# EAGLE design adapter28 (EAGLE 9.4.2)
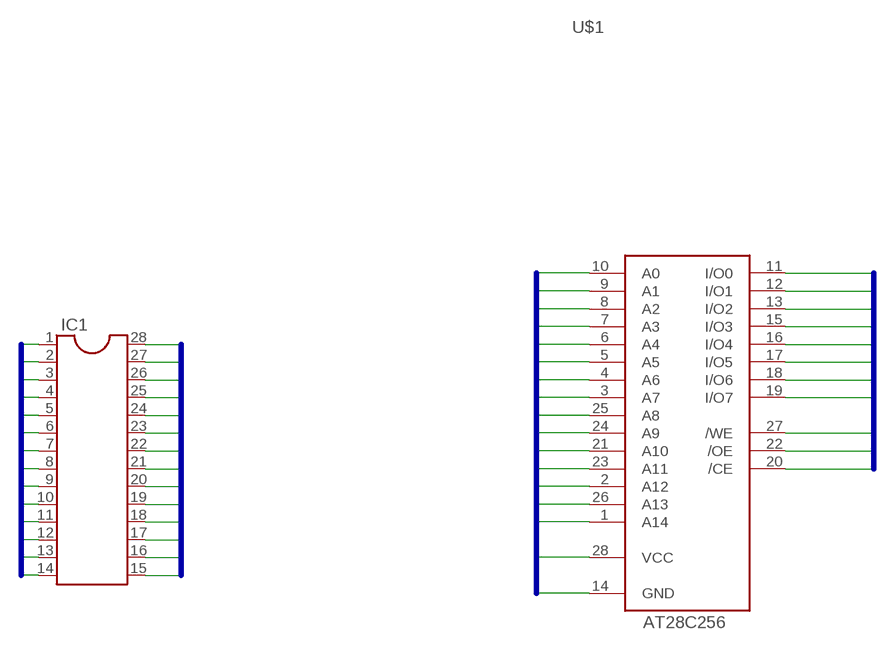
[diagram p0: schematic, sheet 1]

## Parts
IC1  DIL28  [DIL28-6]
U$1  AT28C256  [DIL28-3-ZIF_SOCKET]

## Nets
P1: IC1.1 U$1.1(A14)
P2: IC1.2 U$1.2(A12)
P3: IC1.3 U$1.3(A7)
P4: IC1.4 U$1.4(A6)
P5: IC1.5 U$1.5(A5)
P6: IC1.6 U$1.6(A4)
P7: IC1.7 U$1.7(A3)
P8: IC1.8 U$1.8(A2)
P9: IC1.9 U$1.9(A1)
P10: IC1.10 U$1.10(A0)
P11: IC1.11 U$1.11(I/O0)
P12: IC1.12 U$1.12(I/O1)
P13: IC1.13 U$1.13(I/O2)
P14: IC1.14 U$1.14(GND)
P15: IC1.15 U$1.15(I/O3)
P16: IC1.16 U$1.16(I/O4)
P17: IC1.17 U$1.17(I/O5)
P18: IC1.18 U$1.18(I/O6)
P19: IC1.19 U$1.19(I/O7)
P20: IC1.20 U$1.20(/CE)
P21: IC1.21 U$1.21(A10)
P22: IC1.22 U$1.22(/OE)
P23: IC1.23 U$1.23(A11)
P24: IC1.24 U$1.24(A9)
P25: IC1.25 U$1.25(A8)
P26: IC1.26 U$1.26(A13)
P27: IC1.27 U$1.27(/WE)
P28: IC1.28 U$1.28(VCC)

## Buses
DIL28:P1,P2,P3,P4,P5,P6,P7,P8,P9,P10,P11,P12,P13,P14,P15,P16,P17,P18,P19,P20,P21,P22,P23,P24,P25,P26,P27,P28

## Library data of the parts
IC1 = ic-package:DIL28: Dual In Line
U$1 = wntrmute:AT28C256

## Net classes
0 default: width 0.152 mm, drill 0.254 mm, clearance 0.152 mm

## Board
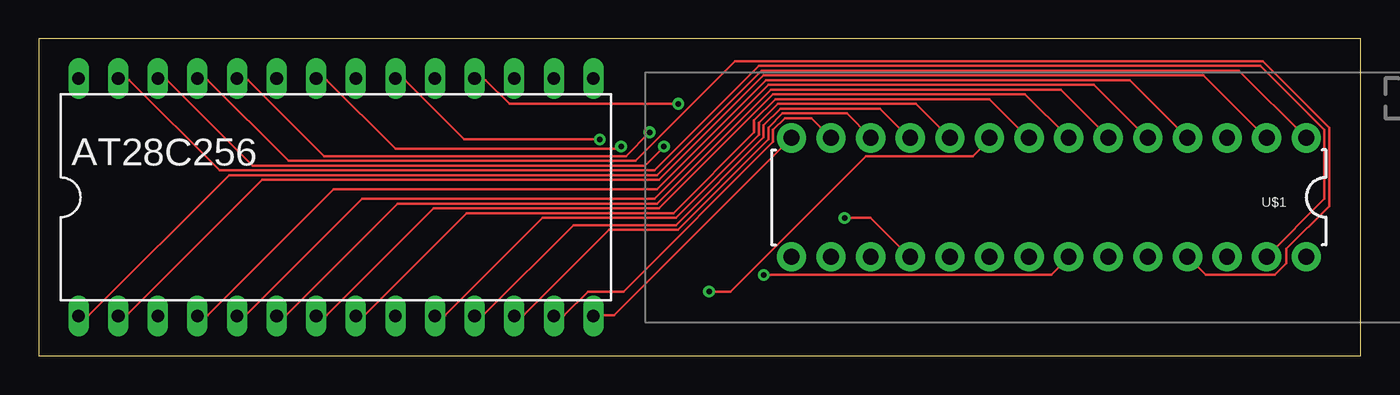
[diagram p1: board, top side]
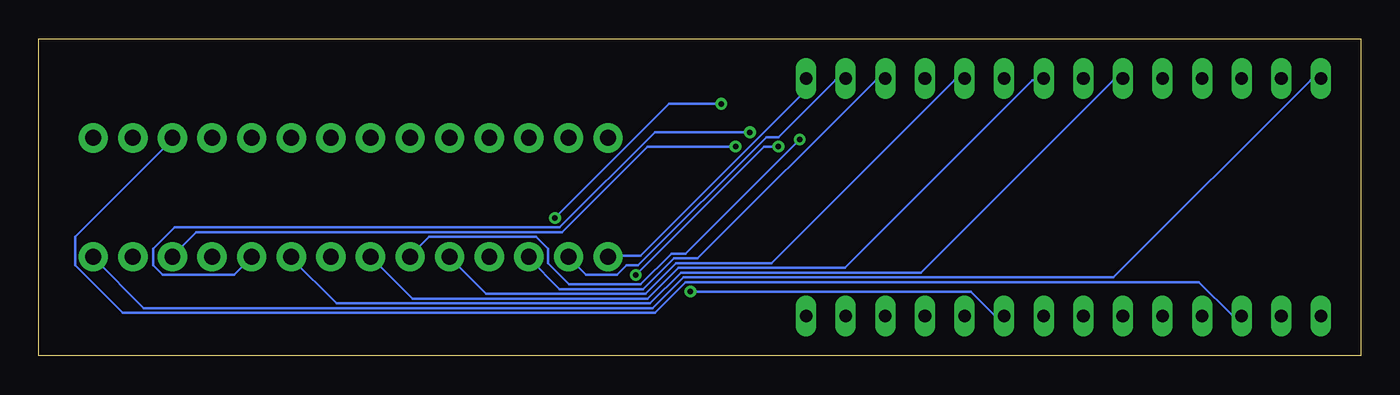
[diagram p2: board, bottom side, seen from below]

Size 84.76 x 20.31 mm. Coordinates in mm from the lower left corner, seen from the top.
Outline: 0,0 84.76,0 84.76,20.31 0,20.31 0,0
Copper layers (1*16): Top 0.035mm / dielectric 1.5mm / Bottom 0.035mm
Design rules "default": minimum track width 6mil, minimum drill 0.35mm, track to track 6mil, track to pad 6mil, pad to pad 6mil, via to via 6mil, smd to smd 6mil, copper to edge 40mil, drill to drill 6mil, minimum pad ring 10mil, minimum via ring 8mil, stop-mask expansion 4mil, vias tented up to drill 0mil, thermal gap 10mil

### Footprints (pad centres in the part's own frame; a part is rotated, then mirrored left to right if it is on the bottom)
DIL28-6 = drill 0.813 long: 1 -16.51,-7.62; 2 -13.97,-7.62; 3 -11.43,-7.62; 4 -8.89,-7.62; 5 -6.35,-7.62; 6 -3.81,-7.62; 7 -1.27,-7.62; 8 1.27,-7.62; 9 3.81,-7.62; 10 6.35,-7.62; 11 8.89,-7.62; 12 11.43,-7.62; 13 13.97,-7.62; 14 16.51,-7.62; 15 16.51,7.62; 16 13.97,7.62; 17 11.43,7.62; 18 8.89,7.62; 19 6.35,7.62; 20 3.81,7.62; 21 1.27,7.62; 22 -1.27,7.62; 23 -3.81,7.62; 24 -6.35,7.62; 25 -8.89,7.62; 26 -11.43,7.62; 27 -13.97,7.62; 28 -16.51,7.62
DIL28-3-ZIF_SOCKET = drill 1.016 pad 1.88: 1 -16.51,-3.81; 2 -13.97,-3.81; 3 -11.43,-3.81; 4 -8.89,-3.81; 5 -6.35,-3.81; 6 -3.81,-3.81; 7 -1.27,-3.81; 8 1.27,-3.81; 9 3.81,-3.81; 10 6.35,-3.81; 11 8.89,-3.81; 12 11.43,-3.81; 13 13.97,-3.81; 14 16.51,-3.81; 15 16.51,3.81; 16 13.97,3.81; 17 11.43,3.81; 18 8.89,3.81; 19 6.35,3.81; 20 3.81,3.81; 21 1.27,3.81; 22 -1.27,3.81; 23 -3.81,3.81; 24 -6.35,3.81; 25 -8.89,3.81; 26 -11.43,3.81; 27 -13.97,3.81; 28 -16.51,3.81

### Placement (x,y rotation side)
IC1  19.05,10.16 0 top
U$1  64.77,10.16 180 top

### Tracks (layer width: path | path; a pad name or v marks a point on that pad's centre or on a via)
P1
  Top 0.152: U$1.1 76.96,18.29 46.33,18.29 39.62,11.58 12.19,11.58 3.2,2.59 2.59,2.59 IC1.1
P2
  Top 0.152: IC1.2 5.18,2.59 5.64,2.59 14.33,11.28 39.78,11.28 46.48,17.98 74.68,17.98 78.64,14.02 U$1.2
P3
  Bottom 0.152: IC1.3 7.62,2.59 8.23,2.59 10.36,4.72 43.28,4.72 45.26,2.74 79.4,2.74 82.45,5.79 82.45,7.62 76.2,13.87 U$1.3
P4
  Top 0.152: U$1.4 69.95,17.68 46.63,17.68 39.62,10.67 18.9,10.67 10.82,2.59 10.21,2.59 IC1.4
P5
  Top 0.152: IC1.5 12.8,2.59 13.26,2.59 20.73,10.06 39.47,10.06 46.79,17.37 67.67,17.37 71.02,14.02 U$1.5
P6
  Top 0.152: IC1.6 15.24,2.59 15.85,2.59 23.01,9.75 39.62,9.75 46.94,17.07 65.53,17.07 68.58,14.02 U$1.6
P7
  Top 0.152: U$1.7 63.25,16.76 47.09,16.76 39.78,9.45 25.3,9.45 18.44,2.59 17.83,2.59 IC1.7
P8
  Top 0.152: IC1.8 20.42,2.59 20.88,2.59 27.43,9.14 40.69,9.14 45.87,14.33 45.87,15.09 47.24,16.46 60.96,16.46 63.4,14.02 U$1.8
P9  (via drill 0.35)
  Top 0.152: v42.98,4.12 44.35,4.12 53.03,12.8 59.89,12.8 60.96,13.87 U$1.9
  Bottom 0.152: v42.98,4.12 24.99,4.12 23.47,2.59 22.86,2.59 IC1.9
P10
  Top 0.152: U$1.10 56.24,16.15 47.4,16.15 46.18,14.94 46.18,14.17 40.84,8.84 32.31,8.84 26.06,2.59 25.45,2.59 IC1.10
P11
  Top 0.152: IC1.11 28.04,2.59 28.5,2.59 34.29,8.38 40.84,8.38 46.48,14.02 46.48,14.78 47.55,15.85 53.95,15.85 55.78,14.02 U$1.11
P12
  Top 0.152: IC1.12 30.48,2.59 31.09,2.59 36.58,8.08 41,8.08 46.79,13.87 46.79,14.63 47.7,15.54 51.82,15.54 53.34,14.02 U$1.12
P13
  Top 0.152: U$1.13 49.53,15.24 47.85,15.24 47.09,14.48 47.09,13.72 37.49,4.12 35.2,4.12 33.68,2.59 33.07,2.59 IC1.13
P14
  Top 0.152: U$1.14 36.88,2.59 35.66,2.59 IC1.14
P15
  Bottom 0.152: IC1.15 35.66,17.68 35.66,16.92 46.18,6.4 48.16,6.4 U$1.15
P16
  Bottom 0.152: IC1.16 33.07,17.68 33.68,17.68 37.34,14.02 38.1,14.02 46.33,5.79 47.09,5.79 47.7,5.18 49.68,5.18 50.75,6.25 U$1.16
P17
  Bottom 0.152: IC1.17 30.48,17.68 31.09,17.68 42.52,6.25 44.04,6.25 46.02,4.27 51.36,4.27 53.34,6.25 U$1.17
P18  (via drill 0.35)
  Top 0.152: v41,16.15 30.18,16.15 28.65,17.68 28.04,17.68 IC1.18 | v51.66,8.84 53.34,8.84 55.78,6.4 U$1.18
  Bottom 0.152: v41,16.15 44.35,16.15 v51.66,8.84
P19
  Bottom 0.152: IC1.19 25.45,17.68 26.06,17.68 37.8,5.94 43.89,5.94 45.87,3.96 56.08,3.96 58.37,6.25 U$1.19
P20  (via drill 0.35)
  Top 0.152: v35.97,13.87 27.28,13.87 23.47,17.68 22.86,17.68 IC1.20
  Bottom 0.152: v35.97,13.87 43.28,6.55 44.2,6.55 46.18,4.57 50.75,4.57 52.12,5.94 52.12,6.86 52.88,7.62 59.74,7.62 60.96,6.4 U$1.20
P21
  Bottom 0.152: U$1.21 60.81,3.66 45.72,3.66 43.74,5.64 33.07,5.64 21.03,17.68 20.42,17.68 IC1.21
P22  (via drill 0.35)
  Top 0.152: v37.34,13.41 37.19,13.26 22.86,13.26 18.44,17.68 17.83,17.68 IC1.22 | v46.48,5.18 64.92,5.18 65.99,6.25 U$1.22
  Bottom 0.152: v37.34,13.41 38.25,13.41 v46.48,5.18
P23
  Bottom 0.152: IC1.23 15.24,17.68 15.85,17.68 28.19,5.33 43.59,5.33 45.57,3.35 65.68,3.35 68.58,6.25 U$1.23
P24  (via drill 0.35)
  Top 0.152: v39.17,14.33 37.64,12.8 18.29,12.8 13.41,17.68 12.8,17.68 IC1.24
  Bottom 0.152: v39.17,14.33 45.26,14.33 51.36,8.23 76.05,8.23 77.42,6.86 77.42,5.79 76.81,5.18 72.24,5.18 71.17,6.25 U$1.24
P25
  Top 0.152: U$1.25 74.83,5.18 79.25,5.18 80.01,5.94 80.01,6.86 82.75,9.6 82.75,14.63 78.49,18.9 44.65,18.9 38.25,12.5 16,12.5 10.82,17.68 10.21,17.68 IC1.25
P26  (via drill 0.35)
  Top 0.152: v40.08,13.41 38.86,12.19 13.72,12.19 8.23,17.68 7.62,17.68 IC1.26
  Bottom 0.152: v40.08,13.41 45.72,13.41 51.21,7.92 74.68,7.92 76.2,6.4 U$1.26
P27
  Top 0.152: U$1.27 82.45,10.06 82.45,14.48 78.33,18.59 46.18,18.59 39.47,11.89 11.58,11.89 5.79,17.68 5.18,17.68 IC1.27
P28
  Bottom 0.152: IC1.28 2.59,17.68 3.2,17.68 15.85,5.03 43.43,5.03 45.41,3.05 78.03,3.05 81.23,6.25 U$1.28

### Text on the board
tPlace: AT28C256